# EAGLE design dual-led-wireless-dimmer-rev-c (EAGLE 9.6.2)
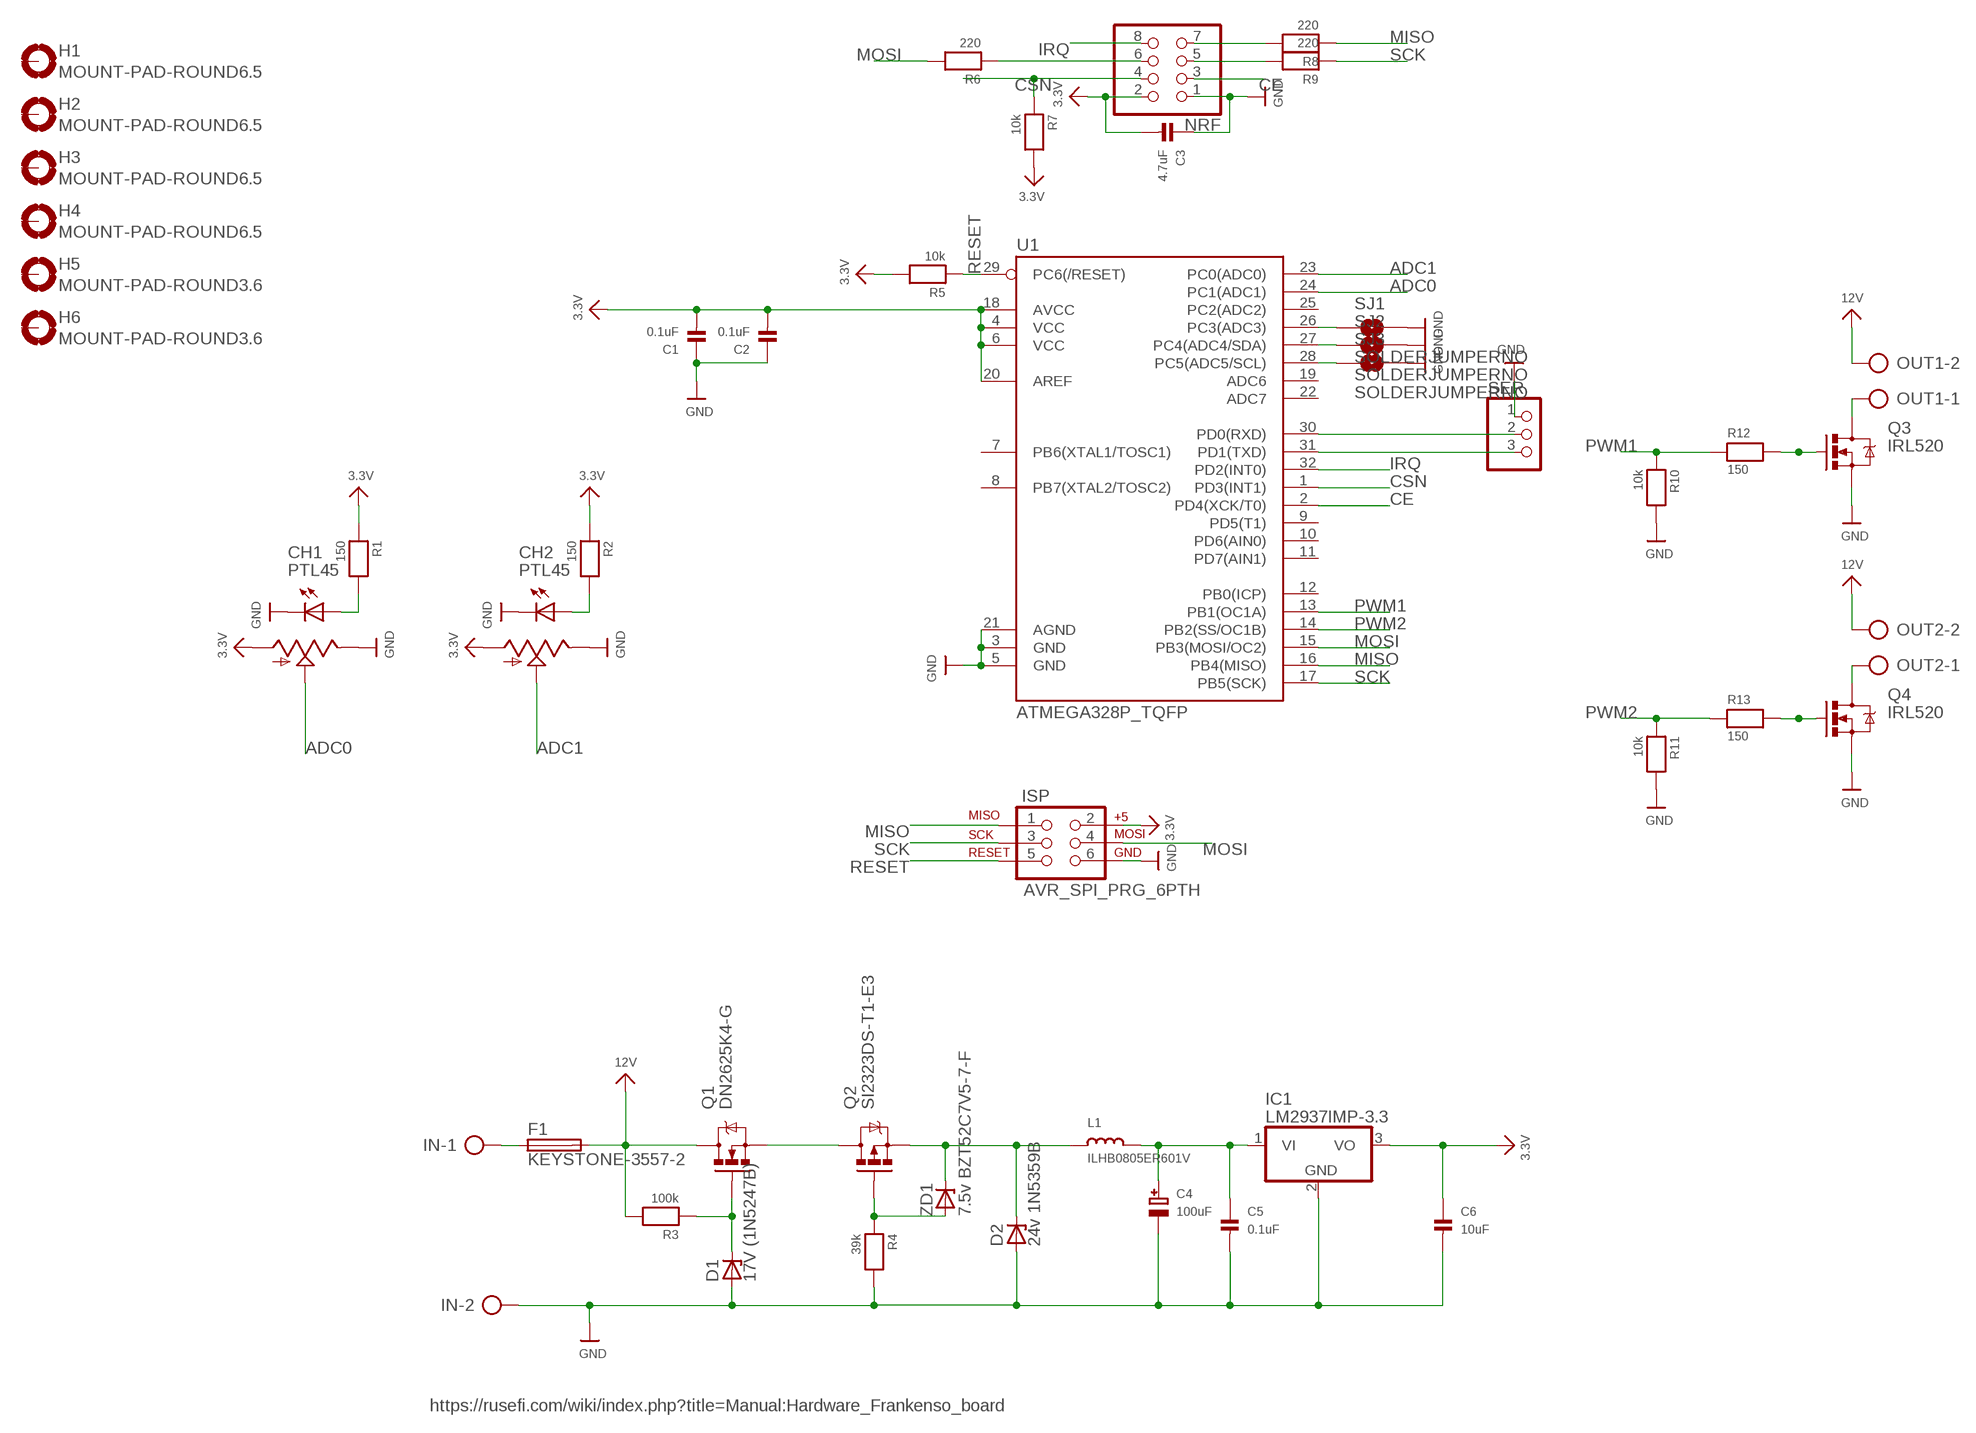
[diagram p0: schematic, sheet 1]

## Parts
C1  0.1uF  CAP_CERAMIC0805  [0805]
C2  0.1uF  CAP_CERAMIC0805  [0805]
C3  4.7uF  CAP_CERAMIC0805  [0805]
C4  100uF  CAP_ELECTROLYTICPANASONIC_D  [PANASONIC_D]
C5  0.1uF  CAP_CERAMIC0805  [0805]
C6  10uF  CAP_CERAMIC0805  [0805]
CH1  PTL45  [BOURNS-PTL45]
CH2  PTL45  [BOURNS-PTL45]
D1  17V (1N5247B)  ZENER-DIODEZD-5  [ZDIO-5]
D2  24v 1N5359B  ZPY  [DO41Z10]
F1  KEYSTONE-3557-2  [KEYSTONE-3557-2]
H1  MOUNT-PAD-ROUND6.5  [6,5-PAD]
H2  MOUNT-PAD-ROUND6.5  [6,5-PAD]
H3  MOUNT-PAD-ROUND6.5  [6,5-PAD]
H4  MOUNT-PAD-ROUND6.5  [6,5-PAD]
H5  MOUNT-PAD-ROUND3.6  [3,6-PAD]
H6  MOUNT-PAD-ROUND3.6  [3,6-PAD]
IC1  LM2937IMP-3.3  LM2937  [TO263-3]
IN  AK500/2-H  [AK500/2-H]
ISP  AVR_SPI_PRG_6PTH  [2X3]
L1  ILHB0805ER601V  INDUCTOR0805  [0805]
NRF  PINHD-2X4  [2X04]
OUT1  AK500/2-H  [AK500/2-H]
OUT2  AK500/2-H  [AK500/2-H]
Q1  DN2625K4-G  MOSFET-NCHANNELFDD8780  [DPAK]
Q2  SI2323DS-T1-E3  MOSFET-PCHANNEL  [SOT23-3]
Q3  IRL520  MOSFET-NCHANNELFQP30N06L  [TO220V]
Q4  IRL520  MOSFET-NCHANNELFQP30N06L  [TO220V]
R1  150  RESISTOR0805  [0805]
R2  150  RESISTOR0805  [0805]
R3  100k  RESISTOR0805  [0805]
R4  39k  RESISTOR0805  [0805]
R5  10k  RESISTOR0805  [0805]
R6  220  RESISTOR0805  [0805]
R7  10k  RESISTOR0805  [0805]
R8  220  RESISTOR0805  [0805]
R9  220  RESISTOR0805  [0805]
R10  10k  RESISTOR0805  [0805]
R11  10k  RESISTOR0805  [0805]
R12  150  RESISTOR0805  [0805]
R13  150  RESISTOR0805  [0805]
SER  PINHD-1X3  [1X03]
SJ1  SOLDERJUMPERNO  [SJ_2S-NO]
SJ2  SOLDERJUMPERNO  [SJ_2S-NO]
SJ3  SOLDERJUMPERNO  [SJ_2S-NO]
U1  ATMEGA328P_TQFP  [TQFP32-08]
ZD1  7.5v BZT52C7V5-7-F  ZD-SOD123  [SOD123]

## Nets
3.3V: C1.2 C2.2 C3.2 C6.1 CH1.1(A) CH2.1(A) IC1.3(VO) ISP.2 NRF.2 R1.1 R2.1 R5.2 R7.2 U1.4(VCC) U1.6(VCC) U1.18(AVCC) U1.20(AREF)
12V: F1.R1 F1.R2 OUT1.2 OUT2.2 Q1.4(D) R3.2
ADC0: CH1.2(S) U1.24(PC1(ADC1))
ADC1: CH2.2(S) U1.23(PC0(ADC0))
CE: NRF.3 U1.2(PD4(XCK/T0))
CSN: NRF.4 R7.1 U1.1(PD3(INT1))
GND: C1.1 C2.1 C3.1 C4.- C5.2 C6.2 CH1.3(E) CH1.E(LED-) CH2.3(E) CH2.E(LED-) D1.A D2.A IC1.2(GND) IN.2 ISP.6 NRF.1 Q3.3(S) Q4.3(S) R4.2 R10.2 R11.2 SER.1 SJ1.2 SJ2.2 SJ3.2 U1.3(GND) U1.5(GND) U1.21(AGND)
IRQ: NRF.8 U1.32(PD2(INT0))
MISO: ISP.1 R8.1 U1.16(PB4(MISO))
MOSI: ISP.4 R6.2 U1.15(PB3(MOSI/OC2))
N$1: Q3.1(G) R12.2
N$2: Q4.1(G) R13.2
N$3: CH1.B(LED+) R1.2
N$4: CH2.B(LED+) R2.2
N$5: F1.L1 F1.L2 IN.1
N$6: OUT1.1 Q3.2(D)
N$7: NRF.6 R6.1
N$8: OUT2.1 Q4.2(D)
N$9: NRF.7 R8.2
N$10: SJ1.1 U1.26(PC3(ADC3))
N$11: D1.C Q1.1(G) R3.1
N$12: SJ2.1 U1.27(PC4(ADC4/SDA))
N$13: Q1.3(S) Q2.3(D)
N$14: Q2.1(G) R4.1 ZD1.A
N$15: D2.C L1.1 Q2.2(S) ZD1.C
N$16: SJ3.1 U1.28(PC5(ADC5/SCL))
N$17: C4.+ C5.1 IC1.1(VI) L1.2
N$19: SER.3 U1.31(PD1(TXD))
N$20: SER.2 U1.30(PD0(RXD))
N$66: NRF.5 R9.2
PWM1: R10.1 R12.1 U1.13(PB1(OC1A))
PWM2: R11.1 R13.1 U1.14(PB2(SS/OC1B))
RESET: ISP.5 R5.1 U1.29(PC6(/RESET))
SCK: ISP.3 R9.1 U1.17(PB5(SCK))
Unconnected: H1.B6,5(MOUNT) H2.B6,5(MOUNT) H3.B6,5(MOUNT) H4.B6,5(MOUNT) H5.B3,6(MOUNT) H6.B3,6(MOUNT) U1.7(PB6(XTAL1/TOSC1)) U1.8(PB7(XTAL2/TOSC2)) U1.9(PD5(T1)) U1.10(PD6(AIN0)) U1.11(PD7(AIN1)) U1.12(PB0(ICP)) U1.19(ADC6) U1.22(ADC7) U1.25(PC2(ADC2))

## Notes on the sheet
- https://rusefi.com/wiki/index.php?title=Manual:Hardware_Frankenso_board

## Library data of the parts
C1-C3 C5 C6 = microbuilder:CAP_CERAMIC: Ceramic Capacitors 0402 - 0402 Surface Mount Capacitors 16pF 50V 5% [Digikey: 445-4899-2-ND] 18pF 50V 5% [Digikey: 490-1281-2-ND] 22pF 50V 5% [Digikey: 490-1283-2-ND] 68pF 50V 5% [Digikey: 490-1289-2-ND] 0.1uF 10V 10% [Digikey: 490-1318-2-ND] 1.0uF 6.3V 10% [Digikey: 490-1320-2-ND] 0603 - 0603 Surface Mount Capacitors 16 pF 50V 5% [Digikey: 445-5051-2-ND] 22 pF 50V [Digikey: PCC220ACVTR-ND] 33 pF 50V 5% [Digikey: 490-1415-1-ND] 56pF 50V 5% [Digikey: 490-1421-1-ND] 220pF 50V 5% [Digikey: 445-1285-1-ND] 680 pF 50V 2200 pF 50V 5% C0G [Digikey: 445-1297-1-ND] 5600 pF 100V 5% X7R [Digikey: 478-3711-1-ND] 0.1 µF 25V 10% [Digikey: PCC2277TR-ND] 0.22 µF 16V 10% X7R [Digikey: 445-1318-1-ND] 1.0 µF 25V 10% [Digikey: 445-5146-2-ND] 0603 - RF Specific 3pF 250V +/-0.1pF RF [Digikey: 712-1347-1-ND] 18 pF 250V 5% [Digikey: 478-3505-1-ND or 712-1322-1-ND] 56 pF 250V 5% C0G RF [Digikey: 490-4867-1-ND] 68 pF 250V RF [Digikey: 490-4868-1-ND] 0805 - 0805 Surface Mount Capacitors 220 pF 250V 2% RF Ceramic Capacitor [Digikey: 712-1398-1-ND] 1000 pF 50V 2% NP0 Ceramic Capacitor [Digikey: 478-3760-1-ND] 0.1 µF 25V 10% Ceramic Capacitor [Digikey: PCC1828TR-ND] 1.0 µF 16V 10% Ceramic Capacitor[Digikey: 490-1691-2-ND] 10.0 µF 10V 10% Ceramic Capacitor[Digikey: 709-1228-1-ND] 10.0 uF 16V 10% Ceramic Capacitor [Digikey: 478-5165-2-ND] 47 uF 6.3V 20% Ceramic Capacitor [Digikey: 587-1779-1-ND or 399-5506-1-ND] 1206 - 1206 Surface Mount Capacitors 47uF 10V 20% Ceramic Capacitor [Digikey: 490-5528-1-ND or 399-5508-1-ND or 445-6010-1-ND] 100uF 6.3V -20%, +80% Y5V Ceramic Capacitor (Digikey: 490-4512-1-ND, Mouser: 81-GRM31CF50J107ZE1L)
C4 = microbuilder:CAP_ELECTROLYTIC: Electrolytic Capacitors SMT PANASONIC_C - Size C Panasonic Electrolytic Aluminum Capacitor 47µF 16V 20% Electrolytic Capacitor [Digikey: PCE3890TR-ND] PANASONIC_D - Size D Panasonic Electrolytic Aluminum Capacitor 100µF 25V 20% Electrolytic Capacitor [Digikey: PCE3898TR-ND] PTH 3.5 mm grid, 8 mm diameter ... 3.5 mm grid, 10 mm diameter ...
CH1 = keves-ng:PTL45; SPICEPREFIX: C
CH2 = keves-ng:PTL45
D1 = diode:ZENER-DIODE: Z-Diode
D2 = diode:ZPY: Z DIODE 1 W
F1 = keves-ng:KEYSTONE-3557-2: THM 2 in 1 Auto Blade Holder P/N 3557-2 Fuse Reference: Littelfuse ATO 257 series / Bussmann ATC series / APR / Littelfuse 891,897 series / Bussmann ATM-LP series / APS or equivalent http://www.keyelco.com/product.cfm/product_id/296
H1-H6 = keves-ng:MOUNT-PAD-ROUND: MOUNTING PAD, round
IC1 = linear:LM2937: LM2937-2.5, LM2937-3.3 400mA and 500mA Voltage Regulators Source: http://cache.national.com/ds/LM/LM2937-2.5.pdf
IN OUT1 OUT2 = con-ptr500:AK500/2-H: CONNECTOR Aug. 2004 / PTR Meßtechnik: Die Bezeichnung der Serie AK505 wurde geändert. Es handelt sich hierbei um AK500 in horizontaler Ausführung.; OC_FARNELL: unknown; OC_NEWARK: unknown
ISP = SparkFun-Connectors:AVR_SPI_PRG_6: AVR ISP 6 Pin This is the reduced ISP connector for AVR programming. Common on Arduino. This footprint will take up less PCB space and can be used with a 10-pin to 6-pin adapter such as SKU: BOB-08508 **Special note about "TEST_POINT" package. The stop mask is on the top side, so if you want your programming test points to be on the bottom of your board, make sure to place this package on the bottom side of the board. This also ensure that the orientation to program from the bottom side will be correct.
L1 = microbuilder:INDUCTOR: Inductors 0603: 10nH Ceramic Inductor - microwire antenna/RF (Digikey: 712-1434-2-ND) 0805: 560nH Ceramic Inductor - RF (Digikey: 553-1047-1-ND) 270nH Ceramic Inductor - Q = 40@250MHz, +-5%, 1 Ohm DC Resistance (Digikey: 535-10506-2-ND) 1007 (2518 Metric) SMT: 10µH 10% 250mOhm 820mA 1007 Inductor (Digikey: 587-2189-1-ND) 22µH 10% 500mOhm 580mA 1007 Inductor (Digikey: 587-2190-1-ND) 47µH 10% 950mOhm 420mA 1007 Inductor (Digikey: 587-2191-1-ND) 47µH 5% 100mOhm 1A 1008 Inductor (Digikey: 732-1816-1-ND) 5.0x5.0mm (Taiyo Yuden NR5040 Series) 6.8µH 20% 2.3A 64mOhm Inductor (Digikey: 587-2374-2-ND) 5.0x5.0mm (TDK VLC5045 Series) 4.7µH 20% 3.3A 34mOhm Inductor (Digikey: 445-6526-1-ND) 6.8µH 20% 2.7A 46mOhm Inductor (Digikey: 445-6527-1-ND) 6.0x6.0mm (TDK VLC6045 Series) 4.7µH 20% 3.8A 27mOhm Inductor (Digikey: 445-6538-2-ND) 6.8µH 20% 3A 41mOhm Inductor (Digikey: 445-6540-1-ND) 6.2µH 30% 2.2A 45mOhm Inductor (Digikey: SRR5028-6R2YCT-ND) - Not TDK VLC6045 but footprint should match 6.0x6.0mm (TDK SLF6045 Series) 6.8uH 30% 2A 33mOhm Inductor (Digikey: 445-4572-1-ND, Mouser: 810-SLF645T6R8N2R0PF)
NRF = pinhead:PINHD-2X4: PIN HEADER
Q1 = SparkFun-DiscreteSemi:MOSFET-NCHANNEL: Common NMOSFET Parts MFG P/N Store ID Prod ID FDD8780 TRANS-09984 SI7820DN TRANS-11055 FDS6630A IC-08089 2N7002PW TRANS-11151 FQP30N06L COM-10213 TRANS-10060 BSS123LT1G TRANS-08345 BSS138 TRANS-00830 BS170 2N7000; PROD_ID: TRANS-09984
Q2 = SparkFun-DiscreteSemi:MOSFET-PCHANNEL: Generic PMOSFET IRLML2244 - TRANS-11153 (SOT-23 -20V -4.3A) (1.Gate 2.Source 3.Drain) FQP27P06 - COM-10349 <http://www.sparkfun.com/products/10349> (TO-220 -60V -27A) (1.Gate 2.Source 3.Drain); PROD_ID: TRANS-08285
Q3 Q4 = keves-ng:MOSFET-NCHANNEL: Common NMOSFET Parts MFG P/N Store ID Prod ID FDD8780 TRANS-09984 SI7820DN TRANS-11055 FDS6630A IC-08089 2N7002PW TRANS-11151 FQP30N06L COM-10213 TRANS-10060 BSS123LT1G TRANS-08345 BSS138 TRANS-00830 BS170 2N7000; PROD_ID: TRANS-10060
R1-R13 = microbuilder:RESISTOR: Resistors 0402 - 0402 Surface Mount Package 22 Ohm 1% 1/16W [Digikey: 311-22.0LRTR-ND] 33 Ohm 5% 1/16W 1.0K 5% 1/16W 1.5K 5% 1/16W 2.0K 1% 1/16W 10.0K 1% 1/16W [Digikey: 311-10.0KLRTR-ND] 10.0K 5% 1/16W [Digikey: RMCF0402JT10K0TR-ND] 12.1K 1% 1/16W [Digikey: 311-22.0LRTR-ND] 100.0K 5% 1/16W 0603 - 0603 Surface Mount Package 0 Ohm 1/10 Watt 1% Resistor 15 Ohm 1/10 Watt 1% Resistor 33 Ohm 1/10 Watt 1% Resistor 49.9 Ohm 1/10 Watt 1% Resistor 100 Ohm 1/10 Watt 1% Resistor 150 Ohm 1/10 Watt 1% Resistor 240 Ohm 1/10 Watt 1% Resistor 390 Ohm 1/10 Watt 1% Resistor 560 Ohm 1/10 Watt 1% Resistor 680 Ohm 1/10 Watt 1% Resistor 750 Ohm 1/10 Watt 1% Resistor 1.0K Ohm 1/10 Watt 1% Resistor 1.5K Ohm 1/10 Watt 1% Resistor 2.0K Ohm 1/10 Watt 1% Resistor 2.2K Ohm 1/10 Watt 1% Resistor 3.3K Ohm 1/10 Watt 1% Resistor 4.7K Ohm 1/10 Watt 1% Resistor 10.0K Ohm 1/10 Watt 1% Resistor 12.0K Ohm 1/10 Watt 1% Resistor 12.1K Ohm 1/10 Watt 1% Resistor 20.0K Ohm 1/10 Watt 1% Resistor 33.0K Ohm 1/10 Watt 1% Resistor 100.0K Ohm 1/10 Watt 1% Resistor 0805 - 0805 Surface Mount Package 0 Ohm 1/8 Watt 1% Resistor 33 Ohm 1/8 Watt 1% Resistor 100 Ohm 1/8 Watt 1% Resistor 150 Ohm 1/8 Watt 1% Resistor 200 Ohm 1/8 Watt 1% Resistor 240 Ohm 1/8 Watt 1% Resistor 330 Ohm 1/8 Watt 1% Resistor 390 Ohm 1/8 Watt 1% Resistor 470 Ohm 1/8 Watt 1% Resistor 1.0K Ohm 1/8 Watt 1% Resistor 1.5K Ohm 1/8 Watt 1% Resistor 2.0K Ohm 1/8 Watt 1% Resistor 4.7K Ohm 1/8 Watt 1% Resistor 5.1K Ohm 1/8 Watt 1% Resistor 5.6K Ohm 1/8 Watt 1% Resistor 10.0K Ohm 1/8 Watt 1% Resistor 22.0K Ohm 1/8 Watt 1% Resistor 33.0K Ohm 1/8 Watt 1% Resistor 100K Ohm 1/8 Watt 1% Resistor 1206 - 1206 Surface Mount Package 2012 - 2010 Surface Mount Package 0.11 Ohm 1/2 Watt 1% Resistor - Digikey: RHM.11UCT-ND
SER = pinhead:PINHD-1X3: PIN HEADER
SJ1-SJ3 = SparkFun-Retired:SOLDERJUMPER: Solder Jumper Standard SMD solder jumper. Used to automate production. Two varients : Normally Open and Normally Closed are the same, but have different paste layers. NC will have a large amount of paste and should jumper during reflow.
U1 = SparkFun-DigitalIC:ATMEGA328P_TQFP; PROD_ID: IC-09069
ZD1 = diodes:ZD-: Zener diode

## Net classes
0 default: width 0.254 mm
1 3.3v: width 0.406 mm

## Board
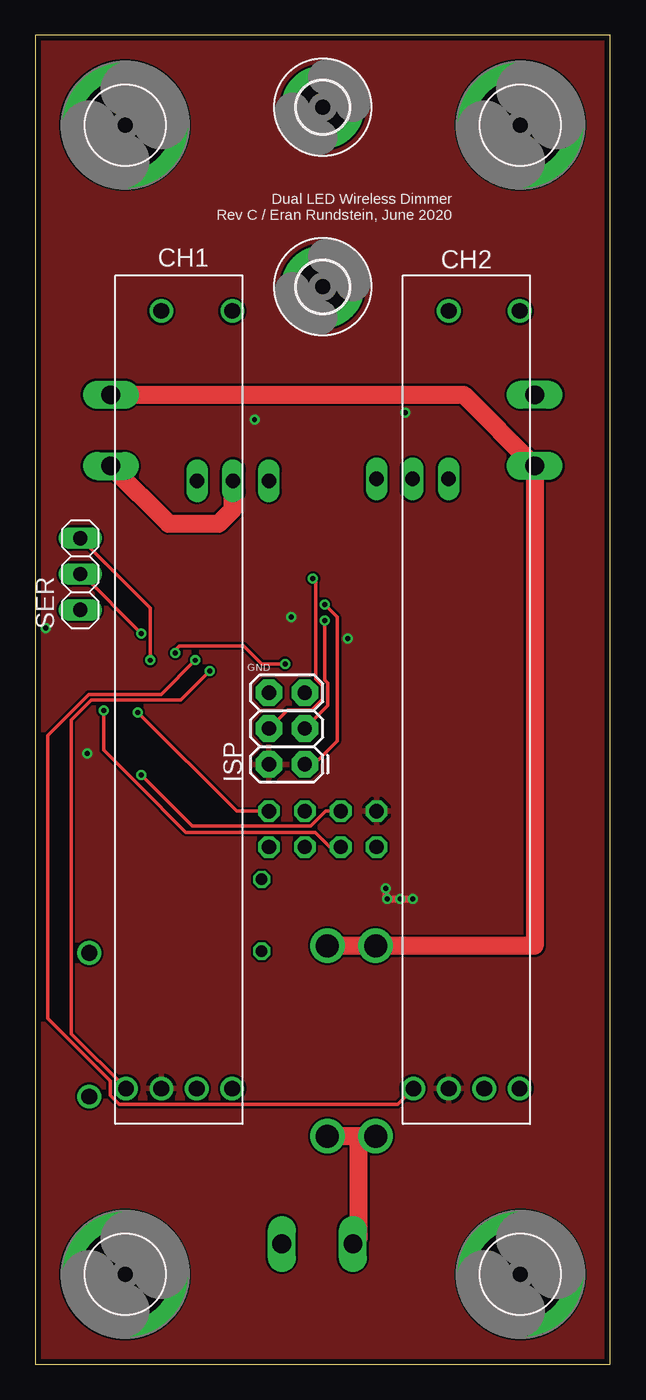
[diagram p1: board, top side]
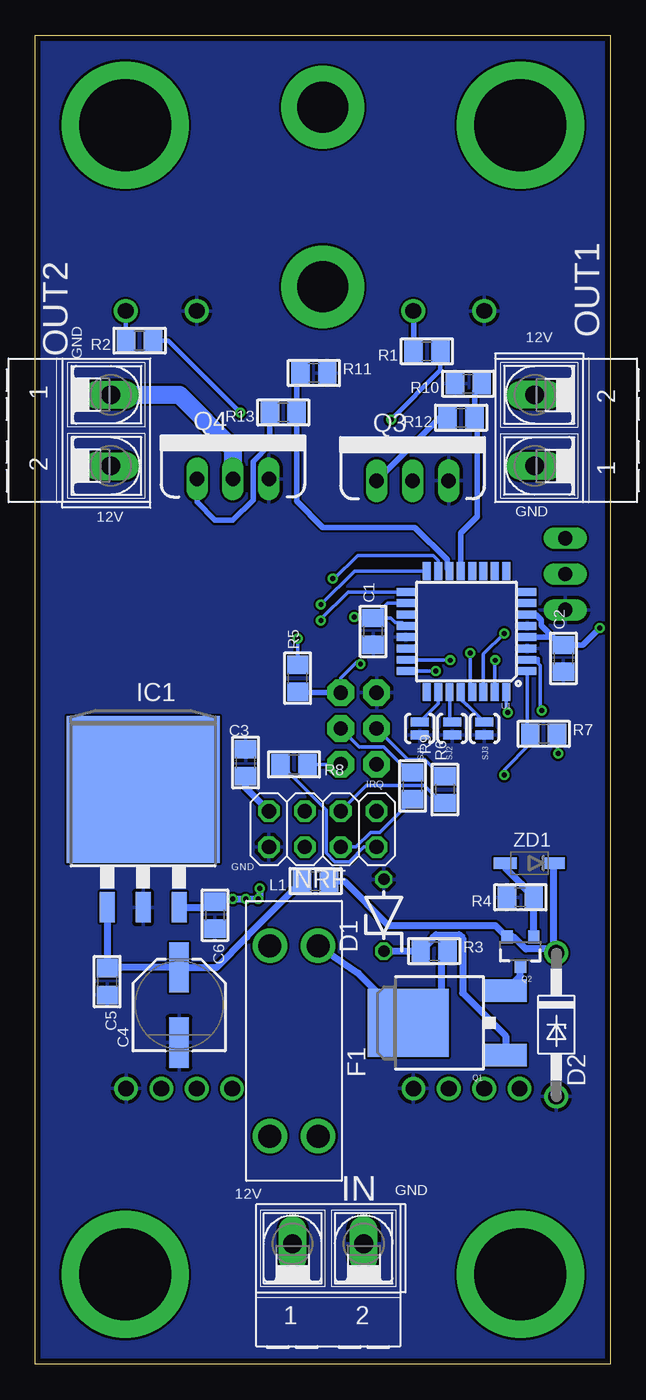
[diagram p2: board, bottom side, seen from below]

Size 40.64 x 93.98 mm. Coordinates in mm from the lower left corner, seen from the top.
Outline: 0,0 40.64,0 40.64,93.98 0,93.98 0,0
Copper layers (1*16): Top 0.0356mm / dielectric 1.5011mm / Bottom 0.0356mm
Design rules "oshpark-2layer-2017-05 *": minimum track width 6mil, minimum drill 13mil, track to track 6mil, track to pad 6mil, pad to pad 6mil, via to via 6mil, smd to smd 6mil, copper to edge 15mil, drill to drill 6mil, minimum pad ring 7mil, minimum via ring 7mil, stop-mask expansion 2.5mil, vias tented up to drill 0mil, thermal gap 10mil

### Footprints (pad centres in the part's own frame; a part is rotated, then mirrored left to right if it is on the bottom)
0805 = smd 1.3 x 1.5: 1 -0.95,0; 2 0.95,0
PANASONIC_D = smd 3.556 x 1.4: + 2.654,0; - -2.654,0
BOURNS-PTL45 = drill 1.118: 1 -27.5,1.25; 2 -27.5,3.75; 3 27.5,1.25; B 27.5,-3.77; E -27.5,-3.75; L -27.5,-1.25
ZDIO-5 = drill 0.813 octagon: A 2.54,0; C -2.54,0
DO41Z10 = drill 1.118: A 5.08,0; C -5.08,0
KEYSTONE-3557-2 = drill 1.626: L1 -6.731,1.702; L2 -6.731,-1.702; R1 6.731,1.702; R2 6.731,-1.702
6,5-PAD = drill 6.5 pad 9: B6,5 0,0
3,6-PAD = drill 3.6 pad 5.842: B3,6 0,0
TO263-3 = smd 1.067 x 2.159: 1 -2.54,-5.791; 2 0,-5.791; 3 2.54,-5.791 | smd 10.8 x 10.41: TAB 0,2.54
AK500/2-H = drill 1.321 long: 1 -2.515,0; 2 2.515,0
2X3 = drill 1.016 pad 1.88 octagon: 1 0,0; 2 0,2.54; 3 2.54,0; 4 2.54,2.54; 5 5.08,0; 6 5.08,2.54
2X04 = drill 1.016 octagon: 1 -3.81,-1.27; 2 -3.81,1.27; 3 -1.27,-1.27; 4 -1.27,1.27; 5 1.27,-1.27; 6 1.27,1.27; 7 3.81,-1.27; 8 3.81,1.27
DPAK = smd 1.6 x 3: 1 -2.28,-5.31; 3 2.28,-5.31 | smd 4.826 x 5.715: 4 0,1.588
SOT23-3 = smd 0.8 x 0.9: 1 -0.95,-1; 2 0.95,-1; 3 0,1.1
TO220V = drill 1.016 long: 1 -2.54,0; 2 0,0; 3 2.54,0
1X03 = drill 1.016 long: 1 -2.54,0; 2 0,0; 3 2.54,0
SJ_2S-NO = smd 0.635 x 1.27: 1 -0.45,0; 2 0.45,0
TQFP32-08 = smd 1.27 x 0.559: 1 -4.293,2.8; 2 -4.293,2; 3 -4.293,1.2; 4 -4.293,0.4; 5 -4.293,-0.4; 6 -4.293,-1.2; 7 -4.293,-2; 8 -4.293,-2.8; 17 4.293,-2.8; 18 4.293,-2; 19 4.293,-1.2; 20 4.293,-0.4; 21 4.293,0.4; 22 4.293,1.2; 23 4.293,2; 24 4.293,2.8 | smd 0.559 x 1.27: 9 -2.8,-4.293; 10 -2,-4.293; 11 -1.2,-4.293; 12 -0.4,-4.293; 13 0.4,-4.293; 14 1.2,-4.293; 15 2,-4.293; 16 2.8,-4.293; 25 2.8,4.293; 26 2,4.293; 27 1.2,4.293; 28 0.4,4.293; 29 -0.4,4.293; 30 -1.2,4.293; 31 -2,4.293; 32 -2.8,4.293
SOD123 = smd 1.6 x 0.8: A 1.7,0; C -1.7,0

### Placement (x,y rotation side)
C1  16.76,51.82 90 bottom
C2  3.3,49.91 90 bottom
C3  25.78,42.55 270 bottom
C4  30.48,25.4 90 bottom
C5  35.56,27.05 270 bottom
C6  27.94,31.75 270 bottom
CH1  10.16,46.99 90 top
CH2  30.48,46.99 90 top
D1  16,31.75 90 bottom
D2  3.81,24 270 bottom
F1  22.35,22.86 90 bottom
H1  34.29,6.35 0 top
H2  6.35,87.63 0 top
H3  34.29,87.63 0 top
H4  6.35,6.35 0 top
H5  20.32,88.9 0 top
H6  20.32,76.2 0 top
IC1  33.02,38.1 0 bottom
IN  19.94,8.51 0 bottom
ISP  19.05,42.42 90 top
L1  20.83,34.16 180 bottom
NRF  20.32,37.85 0 bottom
OUT1  5.33,66.04 90 bottom
OUT2  35.31,66.04 270 bottom
Q1  12.7,24.13 90 bottom
Q2  6.35,29.21 180 bottom
Q3  13.97,62.48 0 bottom
Q4  26.67,62.61 0 bottom
R1  12.95,71.63 180 bottom
R2  33.27,72.39 180 bottom
R3  12.45,29.21 0 bottom
R4  6.35,33.02 180 bottom
R5  22.1,48.51 90 bottom
R6  11.68,40.64 90 bottom
R7  4.7,44.58 0 bottom
R8  22.35,42.42 180 bottom
R9  13.97,40.89 270 bottom
R10  10.03,69.34 180 bottom
R11  20.95,70.1 0 bottom
R12  10.54,66.93 180 bottom
R13  23.11,67.31 180 bottom
SER  3.17,55.88 90 top
SJ1  13.46,44.96 270 bottom
SJ2  11.18,44.96 270 bottom
SJ3  8.89,44.96 270 bottom
U1  10.16,51.82 180 bottom
ZD1  5.71,35.43 180 bottom

### Tracks (layer width: path | path; a pad name or v marks a point on that pad's centre or on a via)
3.3V  (via drill 0.35)
  Top 0.508: v24.77,33.66 24.77,33.02 v24.89,32.89 v25.78,32.89 v26.67,32.89
  Bottom 0.254: C1.2 18.02,52.77 v18.09,52.83 | U1.20 14.69,52.46 15.2,52.46 15.51,52.77 C1.2 | U1.18 15.71,53.82 C1.2 | R5.2 v22.1,51.31 | v3.68,43.18 3.75,43.25 R7.2
  Bottom 0.305: R1.1 12,70.29 v15.49,66.8 | R2.1 31.24,72.39 v26.16,67.31
  Bottom 0.406: U1.4 4.06,51.42 | 4.06,51.42 4.88,52.23 4.88,52.64 5.25,53.02 U1.6 | 4.06,51.42 3.51,50.86 C2.2 1.94,50.86 v0.73,52.07
  Bottom 0.508: IC1.3 27.94,32.31 C6.1 27.94,32.89 v26.67,32.89 v25.78,32.89 v24.89,32.89 24.77,33.02 v24.77,33.66 | NRF.2 25.78,40.77 C3.2
  pour Top: -3.05,96.01 43.43,96.01 44.2,95.25 44.2,-1.02 42.42,-2.79 -3.05,-2.79
12V
  Top 1.27: F1.R2 F1.R1 35.31,29.59 OUT2.2 30.28,68.56 OUT1.2
  Bottom 0.508: F1.R2 17.8,27.64 Q1.4 11.94,24.13 11.94,28.77 R3.2
ADC0  (via drill 0.35)
  Top 0.254: CH1.2 2.54,23.36 2.54,45.57 3.94,46.97 10.26,46.97 v12.32,49.02
  Bottom 0.254: U1.24 12.83,49.02 v12.32,49.02
ADC1  (via drill 0.35)
  Top 0.254: v11.3,49.78 8.89,47.37 3.77,47.37 0.86,44.47 0.86,24.46 5.29,20.03 5.29,19.03 5.95,18.37 25.61,18.37 CH2.2
  Bottom 0.254: U1.23 14.42,49.78 v11.3,49.78
CE  (via drill 0.35)
  Top 0.254: NRF.3 20.83,36.58 19.79,37.62 10.64,37.62 7.24,41.02 7.23,41.02 4.83,43.43 v4.83,46.23
  Bottom 0.254: v4.83,46.23 4.95,46.35 4.95,49.41 5.08,49.54 5.08,49.91 5.77,49.91 U1.2
CSN  (via drill 0.35)
  Top 0.254: NRF.4 20.52,39.12 19.48,38.08 11.07,38.08 v7.49,41.66
  Bottom 0.254: U1.1 5.87,44.8 R7.1 5.65,43.88 7.49,42.04 v7.49,41.66
GND
  pour Bottom: -2.54,95.25 41.91,95.25 41.91,1.27 39.37,-1.27 -2.54,-1.27
IRQ  (via drill 0.35)
  Top 0.254: v7.24,46.1 14.22,39.12 NRF.8
  Bottom 0.254: U1.32 7.36,46.22 v7.24,46.1
MISO  (via drill 0.35)
  Top 0.254: v20.45,53.72 21.34,52.83 21.34,44.07 19.68,42.42 ISP.1
  Bottom 0.254: U1.16 18.06,56.11 v20.45,53.72 | R8.1 ISP.1
MOSI  (via drill 0.35)
  Top 0.254: ISP.4 17.83,46.28 19.55,46.28 20.27,46.99 20.27,48 19.82,48.46 19.82,55.37 v19.62,55.56
  Bottom 0.254: U1.15 12.16,56.84 12.52,57.2 17.85,57.2 19.49,55.56 v19.62,55.56 | ISP.4 14.32,42.77 13.1,42.77 11.92,41.59 R6.2
N$1
  Bottom 0.406: R12.2 12.06,66.93 Q3.1
N$2
  Bottom 0.406: Q4.1 29.21,60.96 27.94,59.69 26.67,59.69 25.25,61.11 25.25,63.84 24.06,65.02 R13.2
N$3
  Bottom 0.406: R1.2 13.9,74.46 CH1.B
N$4
  Bottom 0.305: R2.2 34.25,72.42 CH2.B
N$5
  Top 1.27: F1.L1 22.86,16.13 | 22.86,16.13 F1.L2 | IN.1 22.86,8.91 22.86,16.13
N$6
  Top 1.27: OUT1.1 9.42,59.44 12.95,59.44 13.97,60.45 Q3.2
N$7
  Bottom 0.254: R6.1 11.92,39.69 13.14,40.91 17.25,40.91 NRF.6
N$8
  Bottom 1.27: OUT2.1 30.45,68.56 26.67,64.77 Q4.2
N$9
  Bottom 0.254: R8.2 20.09,39.21 20.09,36.15 19.48,35.53 18.45,35.53 17.41,36.58 NRF.7
N$10
  Bottom 0.254: SJ1.1 12.16,46.71 U1.26
N$11
  Bottom 0.508: D1.C R3.1 12.55,30.05 12.55,30.13 12.31,30.37 10.68,30.37 10.44,30.13 10.44,26.25 7.39,23.2 Q1.1
N$12
  Bottom 0.254: U1.27 11.36,45.59 SJ2.1
N$13
  Bottom 0.508: Q1.3 6.35,27.45 Q2.3
N$14
  Bottom 0.508: Q2.1 R4.1 6.24,33.86 6.24,33.94 7.42,35.11 ZD1.A
N$15
  Bottom 0.508: ZD1.C 4.01,29.29 D2.C 4.08,29.35 5.97,29.35 6.83,30.21 Q2.2 8.12,31.03 15.68,31.03 18.81,34.16 L1.1
N$16
  Bottom 0.254: SJ3.1 10.09,46.61 10.15,46.61 10.56,47.01 U1.28
N$17
  Bottom 0.508: IC1.1 C5.1 35.51,28.05 C4.+ 27.83,28.05 25.68,30.2 25.68,30.26 L1.2
N$19  (via drill 0.35)
  Top 0.254: v8.13,49.78 8.13,53.47 SER.3
  Bottom 0.254: U1.31 8.16,49.5 8.13,49.53 v8.13,49.78
N$20  (via drill 0.35)
  Top 0.254: v7.5,51.69 3.31,55.88 SER.2
  Bottom 0.254: U1.30 8.96,50.22 v7.5,51.69
N$66
  Bottom 0.254: R9.2 16.3,37.62 16.94,37.62 17.98,36.58 NRF.5
PWM1
  Bottom 0.406: U1.13 10.56,58.78 9.4,59.94 9.4,66.74 R12.1 9.59,68.83 R10.1
PWM2
  Bottom 0.406: U1.14 11.53,56.27 11.53,56.89 13.82,59.18 20.32,59.18 22.16,61.03 R13.1 22.16,69.84 R11.1
RESET  (via drill 0.35)
  Top 0.254: v17.65,49.53 16,49.53 14.73,50.8 10.16,50.8 9.78,50.42 v9.91,50.29
  Bottom 0.254: ISP.5 19.05,48.51 17.91,49.66 17.78,49.53 v17.65,49.53 | v9.91,50.29 9.91,47.67 U1.29
  Bottom 0.406: R5.1 22.03,47.5 ISP.5
SCK  (via drill 0.35)
  Top 0.254: v20.45,52.58 20.45,48.4 20.68,48.17 20.68,46.58 ISP.3
  Bottom 0.254: U1.17 18.54,54.62 20.45,52.7 v20.45,52.58 | R9.1 14.21,41.84 16,43.64 17.73,43.64 ISP.3

### Text on the board
tPlace: GND
bPlace: IRQ | GND
tNames: Dual LED Wireless Dimmer / Rev C / Eran Rundstein, June 2020
bNames: GND | 12V | GND | 12V | GND | 12V